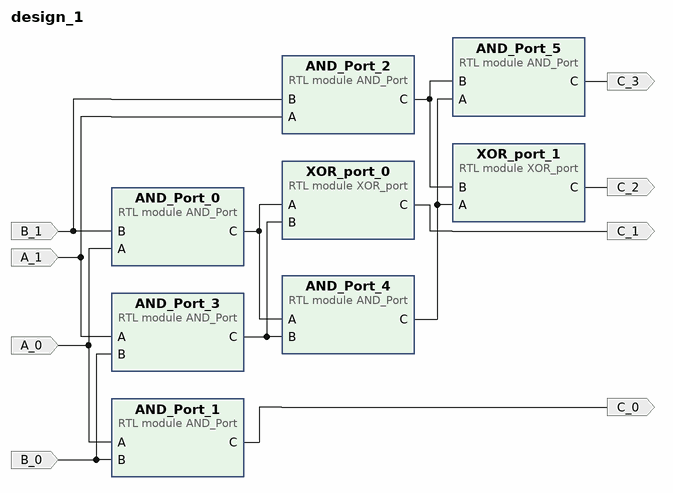
[diagram p0: block diagram of the top level]
# Vivado block design design_1, xc7z020clg400-1, Vivado 2023.1
create_bd_design design_1

create_bd_port -dir I A_0
create_bd_port -dir I A_1
create_bd_port -dir I B_0
create_bd_port -dir I B_1
create_bd_port -dir O C_0
create_bd_port -dir O C_1
create_bd_port -dir O C_2
create_bd_port -dir O C_3

create_bd_cell -type module -reference AND_Port AND_Port_0
create_bd_cell -type module -reference AND_Port AND_Port_1
create_bd_cell -type module -reference AND_Port AND_Port_2
create_bd_cell -type module -reference AND_Port AND_Port_3
create_bd_cell -type module -reference XOR_port XOR_port_0
create_bd_cell -type module -reference AND_Port AND_Port_4
create_bd_cell -type module -reference XOR_port XOR_port_1
create_bd_cell -type module -reference AND_Port AND_Port_5

# ---- connections ----

connect_bd_net [get_bd_pins AND_Port_0/C] [get_bd_pins XOR_port_0/A] [get_bd_pins AND_Port_4/A]
connect_bd_net [get_bd_pins AND_Port_1/C] [get_bd_ports C_0]
connect_bd_net [get_bd_pins AND_Port_2/C] [get_bd_pins AND_Port_5/B] [get_bd_pins XOR_port_1/B]
connect_bd_net [get_bd_pins AND_Port_3/C] [get_bd_pins AND_Port_4/B] [get_bd_pins XOR_port_0/B]
connect_bd_net [get_bd_pins AND_Port_4/C] [get_bd_pins AND_Port_5/A] [get_bd_pins XOR_port_1/A]
connect_bd_net [get_bd_pins AND_Port_5/C] [get_bd_ports C_3]
connect_bd_net -net A_0_1 [get_bd_ports A_0] [get_bd_pins AND_Port_0/A] [get_bd_pins AND_Port_1/A]
connect_bd_net -net A_1_1 [get_bd_ports A_1] [get_bd_pins AND_Port_3/A] [get_bd_pins AND_Port_2/A]
connect_bd_net -net B_0_1 [get_bd_ports B_0] [get_bd_pins AND_Port_1/B] [get_bd_pins AND_Port_3/B]
connect_bd_net -net B_1_1 [get_bd_ports B_1] [get_bd_pins AND_Port_0/B] [get_bd_pins AND_Port_2/B]
connect_bd_net [get_bd_pins XOR_port_0/C] [get_bd_ports C_1]
connect_bd_net [get_bd_pins XOR_port_1/C] [get_bd_ports C_2]

validate_bd_design
save_bd_design
